# Altium schematic sheet H Bridge.SchDoc
size A
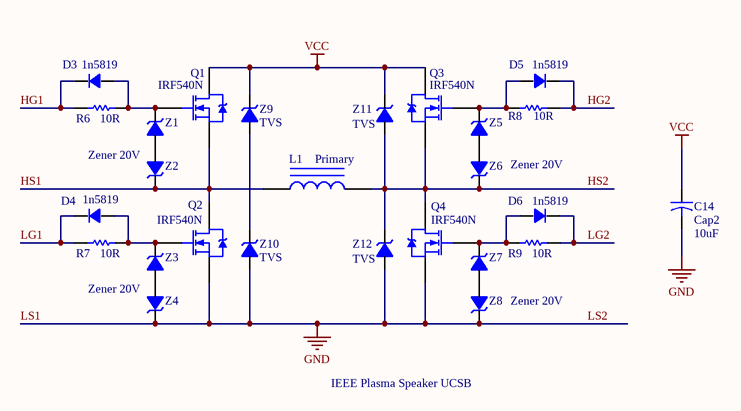
[diagram p0: H Bridge.SchDoc]

## Parts
C14  Cap2  value 10uF  [CAPR5-4X5]
D3  1n5819  [DIODE-0.7]
D4  1n5819  [DIODE-0.7]
D5  1n5819  [DIODE-0.7]
D6  1n5819  [DIODE-0.7]
L1  value Primary  [AXIAL-0.9]  (hidden comment: Inductor Iron)
Q1  IRF540N  [TO-220AB]
Q2  IRF540N  [TO-220AB]
Q3  IRF540N  [TO-220AB]
Q4  IRF540N  [TO-220AB]
R6  value 10R  [AXIAL-0.3]  (hidden comment: 0805)
R7  value 10R  [AXIAL-0.3]  (hidden comment: 0805)
R8  value 10R  [AXIAL-0.3]  (hidden comment: 0805)
R9  value 10R  [AXIAL-0.3]  (hidden comment: 0805)
Z1  Zener 20V  [DIODE-0.7]
Z2  Zener  [DIODE-0.7]  (value not drawn)
Z3  Zener 20V  [DIODE-0.7]
Z4  Zener  [DIODE-0.7]  (value not drawn)
Z5  Zener 20V  [DIODE-0.7]
Z6  Zener  [DIODE-0.7]  (value not drawn)
Z7  Zener 20V  [DIODE-0.7]
Z8  Zener  [DIODE-0.7]  (value not drawn)
Z9  TVS  [DIODE-0.7]
Z10  TVS  [DIODE-0.7]
Z11  TVS  [DIODE-0.7]
Z12  TVS  [DIODE-0.7]

## Nets
LS1: C14.2 Q2.3(S) Q4.3(S) Z4.2 Z8.2 Z10.1 Z12.1  [also labelled GND, LS2]
VCC: C14.1 Q1.2(D) Q3.2(D) Z9.2 Z11.2
HG1: D3.2 R6.2
HG2: D5.2 R8.1
HS1: L1.1 Q1.3(S) Q2.2(D) Z2.2
HS2: L1.2 Q3.3(S) Q4.2(D) Z6.2 Z11.1 Z12.2
LG1: D4.2 R7.2
LG2: D6.2 R9.1
NetD3_1: D3.1 Q1.1(G) R6.1 Z1.2
NetD4_1: D4.1 Q2.1(G) R7.1 Z3.2
NetD5_1: D5.1 Q3.1(G) R8.2 Z5.2
NetD6_1: D6.1 Q4.1(G) R9.2 Z7.2
NetZ1_1: Z1.1 Z2.1
NetZ3_1: Z3.1 Z4.1
NetZ5_1: Z5.1 Z6.1
NetZ7_1: Z7.1 Z8.1
NetZ9_1: Z9.1 Z10.2

## Notes on the sheet
- IEEE Plasma Speaker UCSB

## Library data of the parts
C14 = Cap2: Capacitor; Published: 23-Sep-2002; PackageReference: CAPR5-4X5; Publisher: Altium Limited; PackageDescription: Capacitor; 2 Leads
D3-D6 = Diode S: Zener Diode; Published: 8-Jun-2000; LatestRevisionDate: 17-Jul-2002; LatestRevisionNote: Re-released for DXP Platform.; PackageReference: DIODE-0.7; Publisher: Altium Limited; PackageDescription: Diode, Thru-Hole; 2 Leads; 0.7 in Pin Spacing
L1 = Inductor Iron: Magnetic-Core Inductor; Published: 24-Mar-1999; LatestRevisionDate: 17-Jul-2002; LatestRevisionNote: Re-released for DXP Platform.; PackageReference: AXIAL-0.9; Publisher: Altium Limited; PackageDescription: Axial Device, Thru-Hole; 2 Leads; 0.9 in Pin Spacing
Q1-Q4 = IRF540N: N-Channel Power MOSFET; Note: Pin 2 is electrically connected to pin 4.; Published: 8-Jun-2000; LatestRevisionDate: 17-Jul-2002; LatestRevisionNote: Re-released for DXP Platform.; DatasheetVersion: PD-9.814; PackageVersion: Feb-1997; PackageReference: TO-220AB; Publisher: Altium Limited; PackageDescription: TO, Thru-Hole, Vertical, Heatsink Mounted; 3 In-Line Leads; Pitch 2.54 mm; ComponentLink1Description: Manufacturer Link; ComponentLink1URL: http://www.irf.com/
R6-R9 = Res1: Resistor; Published: 8-Jun-2000; LatestRevisionDate: 17-Jul-2002; LatestRevisionNote: Re-released for DXP Platform.; PackageReference: AXIAL-0.3; Publisher: Altium Limited; PackageDescription: Axial Device, Thru-Hole; 2 Leads; 0.3 in Pin Spacing
Z1-Z12 = Zener: Zener Diode; Published: 8-Jun-2000; LatestRevisionDate: 17-Jul-2002; LatestRevisionNote: Re-released for DXP Platform.; PackageReference: DIODE-0.7; Publisher: Altium Limited; PackageDescription: Diode, Thru-Hole; 2 Leads; 0.7 in Pin Spacing